# Altium schematic sheet N-CW7_Main.SchDoc
size A3; SheetNumber: 1; SheetTotal: 3
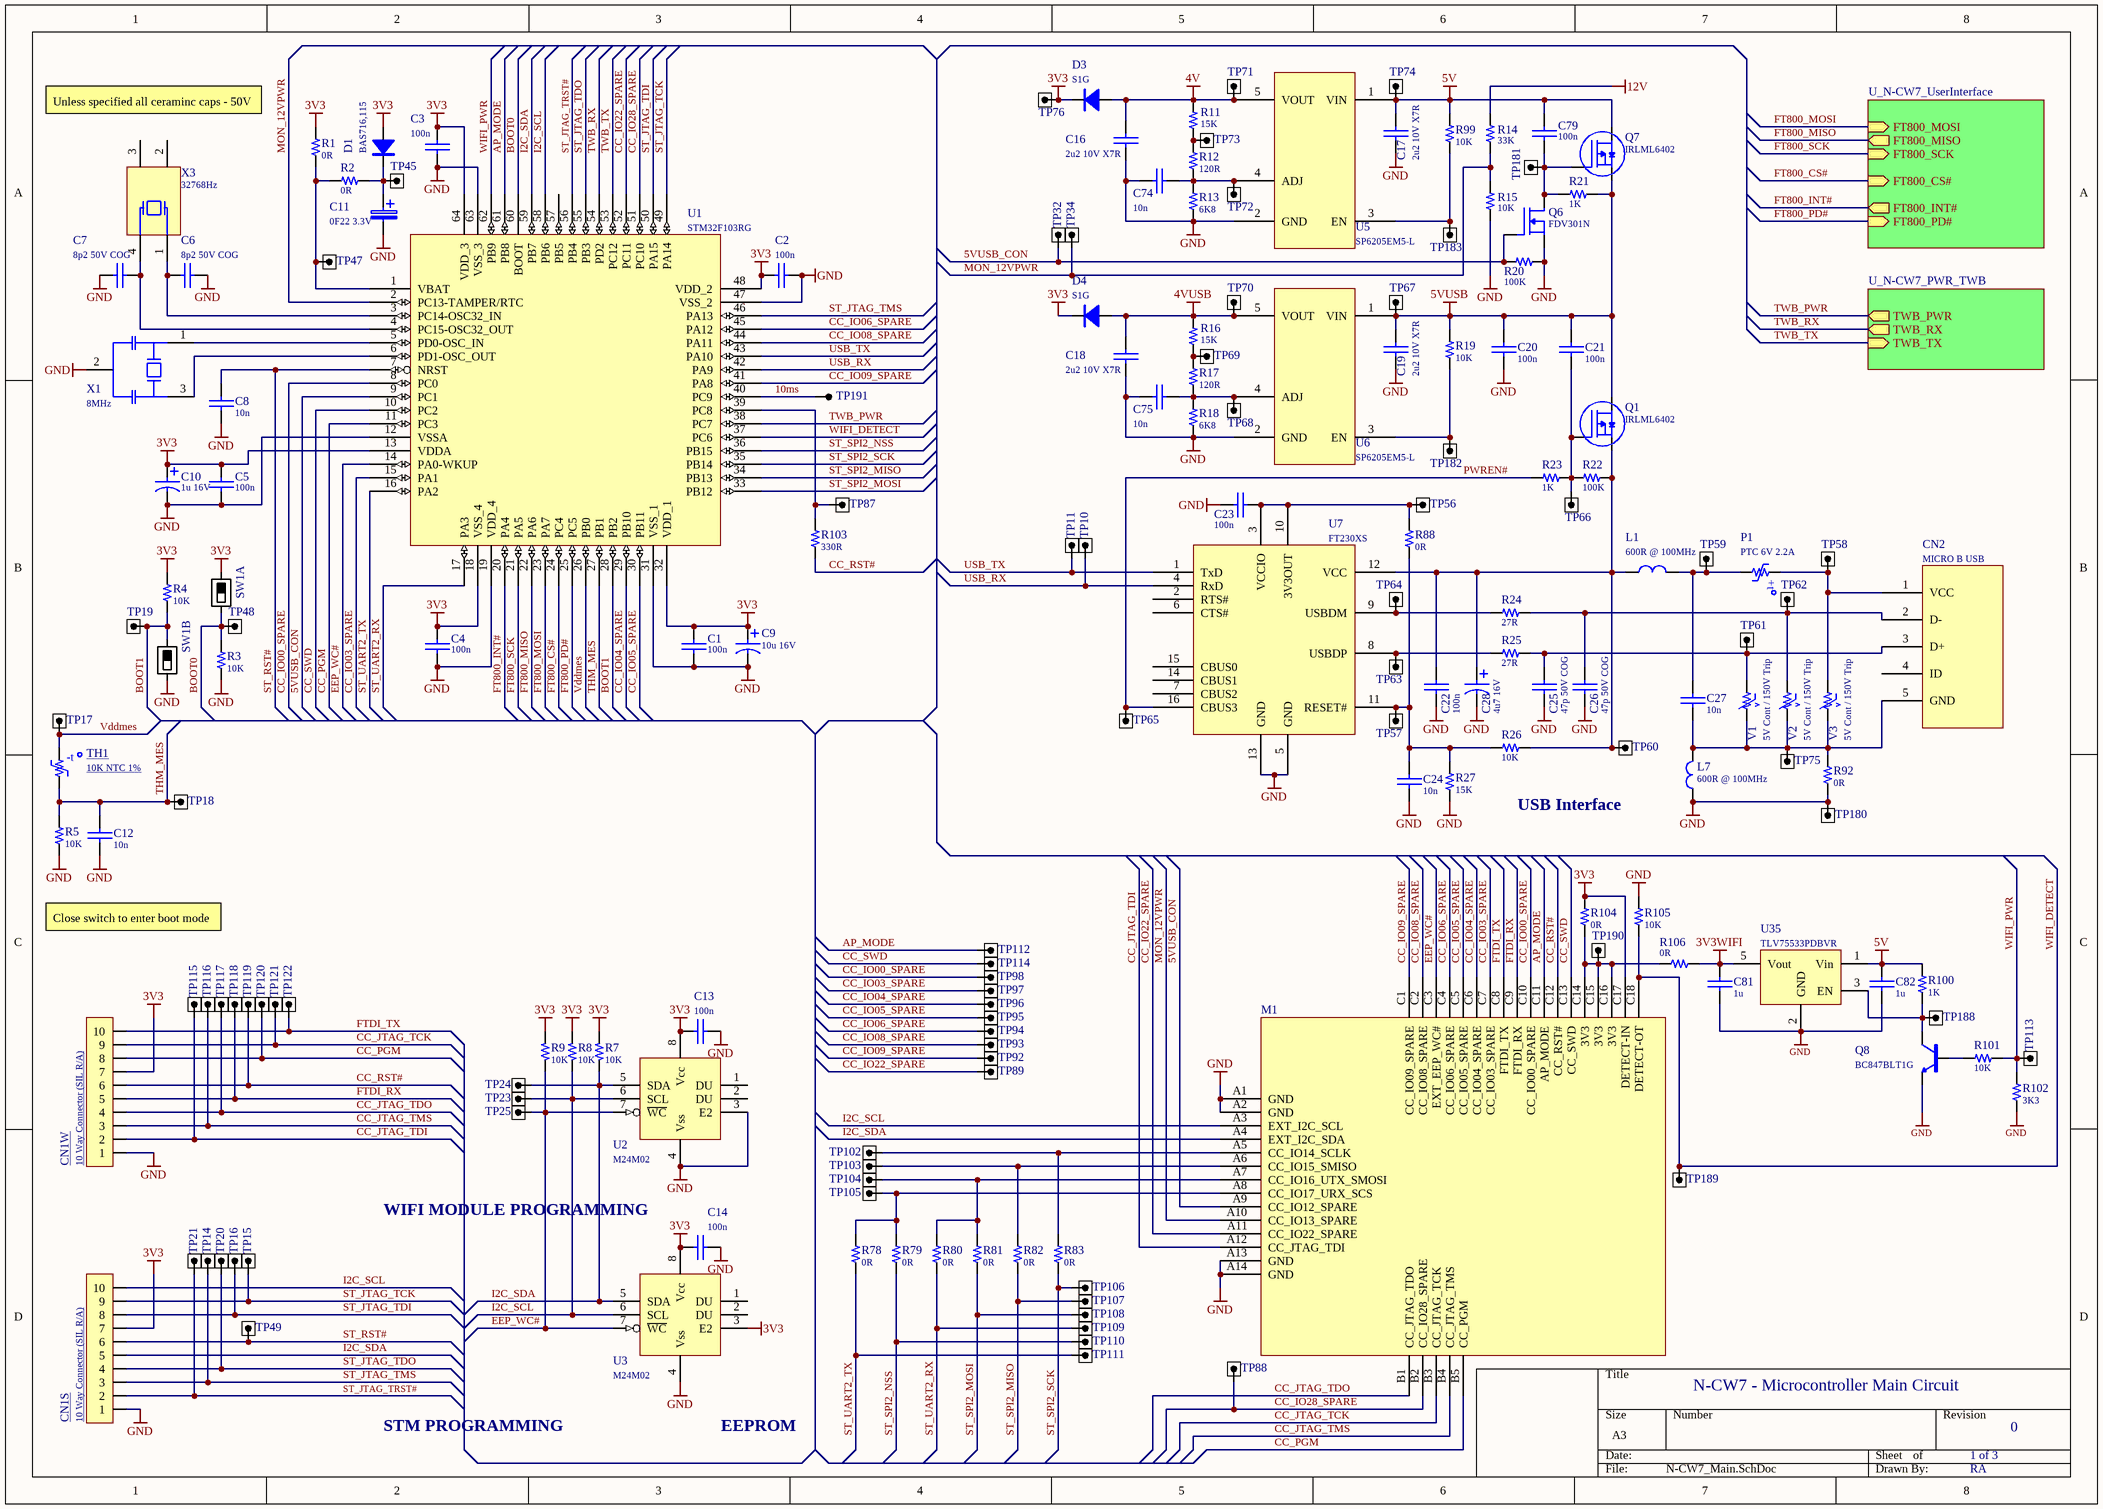
[diagram p0: N-CW7_Main.SchDoc]

## Parts
C1  100n  [TDK_0603_T0.80:CAPC1608X08N]
C2  100n  [TDK_0603_T0.80:CAPC1608X08N]
C3  100n  [TDK_0603_T0.80:CAPC1608X08N]
C4  100n  [TDK_0603_T0.80:CAPC1608X08N]
C5  100n  [TDK_0603_T0.80:CAPC1608X08N]
C6  8p2 50V COG  [KEMET_0603_T0.80:CAPC1608X08N]
C7  8p2 50V COG  [KEMET_0603_T0.80:CAPC1608X08N]
C8  10n  [TDK_0603_T0.80:CAPC1608X08N]
C9  10u 16V  [KEMET_T494B/3528-21:CAPMP3528X19N]
C10  1u 16V  [KEMET_T494A/3216-18:CAPCP3216X16N]
C11  0F22 3.3V  [ELNA_RSCSK2243R3D02008U]
C12  10n  [TDK_0603_T0.80:CAPC1608X08N]
C13  100n  [TDK_0603_T0.80:CAPC1608X08N]
C14  100n  [TDK_0603_T0.80:CAPC1608X08N]
C16  2u2 10V X7R  [TDK_0603_T0.80:CAPC1608X08N]
C17  2u2 10V X7R  [TDK_0603_T0.80:CAPC1608X08N]
C18  2u2 10V X7R  [TDK_0603_T0.80:CAPC1608X08N]
C19  2u2 10V X7R  [TDK_0603_T0.80:CAPC1608X08N]
C20  100n  [TDK_0603_T0.80:CAPC1608X08N]
C21  100n  [TDK_0603_T0.80:CAPC1608X08N]
C22  100n  [TDK_0603_T0.80:CAPC1608X08N]
C23  100n  [TDK_0603_T0.80:CAPC1608X08N]
C24  10n  [TDK_0603_T0.80:CAPC1608X08N]
C25  47p 50V COG  [TDK_0603_T0.80:CAPC1608X08N]
C26  47p 50V COG  [TDK_0603_T0.80:CAPC1608X08N]
C27  10n  [TDK_0603_T0.80:CAPC1608X08N]
C28  4u7 16V  [KEMET_T494A/3216-18:CAPCP3216X16N]
C74  10n  [TDK_0603_T0.80:CAPC1608X08N]
C75  10n  [TDK_0603_T0.80:CAPC1608X08N]
C79  100n  [TDK_0603_T0.80:CAPC1608X08N]
C81  1u  [KEMET_1210_T1.55:CAPC3225X16N]
C82  1u  [KEMET_1210_T1.55:CAPC3225X16N]
CN1S  10 Way Connector (SIL R/A)  [SULLINS_PPTC101LGBN-RC]
CN1W  10 Way Connector (SIL R/A)  [SULLINS_PPTC101LGBN-RC]
CN2  MICRO B USB  [MOLEX:47346-1001]
D1  BAS716,115  [NEXPERIA_BAS716,115_SOD523:SODFL160X65-2N]
D3  S1G  [DIODESINC_S1G_SMA_D0214AC:DIOM4326X24N]
D4  S1G  [DIODESINC_S1G_SMA_D0214AC:DIOM4326X24N]
L1  600R @ 100MHz  [LAIRD_MI0805K601R-10:INDC2012X09N]
L7  600R @ 100MHz  [LAIRD_MI0805K601R-10:INDC2012X09N]
M1  MB-WIFI-CC3200Rev00  [MB-WIFI-CC3200Rev00]  (value not drawn)
P1  PTC 6V 2.2A  [BOURNS_MF-MSMF110-2:INDC4632X08N]
Q1  IRLML6402  [IR_IRLML6402TRPBF_SOT23:SOT95P237X112-3N]
Q6  FDV301N  [ONSEMI_FDV301N_SOT23:SOT95P230X110-3N]
Q7  IRLML6402  [IR_IRLML6402TRPBF_SOT23:SOT95P237X112-3N]
Q8  BC847BLT1G  [ONSEMI_BC847BLT1G_SOT23:SOT95P230X110-3N]
R1  0R  [YAGEO_0603_T0.55:RESC1608X06N]
R2  0R  [YAGEO_0603_T0.55:RESC1608X06N]
R3  10K  [YAGEO_0603_T0.55:RESC1608X06N]
R4  10K  [YAGEO_0603_T0.55:RESC1608X06N]
R5  10K  [YAGEO_0603_T0.55:RESC1608X06N]
R7  10K  [YAGEO_0603_T0.55:RESC1608X06N]
R8  10K  [YAGEO_0603_T0.55:RESC1608X06N]
R9  10K  [YAGEO_0603_T0.55:RESC1608X06N]
R11  15K  [YAGEO_0603_T0.55:RESC1608X06N]
R12  120R  [YAGEO_0603_T0.55:RESC1608X06N]
R13  6K8  [YAGEO_0603_T0.55:RESC1608X06N]
R14  33K  [YAGEO_0603_T0.55:RESC1608X06N]
R15  10K  [YAGEO_0603_T0.55:RESC1608X06N]
R16  15K  [YAGEO_0603_T0.55:RESC1608X06N]
R17  120R  [YAGEO_0603_T0.55:RESC1608X06N]
R18  6K8  [YAGEO_0603_T0.55:RESC1608X06N]
R19  10K  [YAGEO_0603_T0.55:RESC1608X06N]
R20  100K  [YAGEO_0603_T0.55:RESC1608X06N]
R21  1K  [YAGEO_0603_T0.55:RESC1608X06N]
R22  100K  [YAGEO_0603_T0.55:RESC1608X06N]
R23  1K  [YAGEO_0603_T0.55:RESC1608X06N]
R24  27R  [YAGEO_0603_T0.55:RESC1608X06N]
R25  27R  [YAGEO_0603_T0.55:RESC1608X06N]
R26  10K  [YAGEO_0603_T0.55:RESC1608X06N]
R27  15K  [YAGEO_0603_T0.55:RESC1608X06N]
R78  0R  [YAGEO_0603_T0.55:RESC1608X06N]
R79  0R  [YAGEO_0603_T0.55:RESC1608X06N]
R80  0R  [YAGEO_0603_T0.55:RESC1608X06N]
R81  0R  [YAGEO_0603_T0.55:RESC1608X06N]
R82  0R  [YAGEO_0603_T0.55:RESC1608X06N]
R83  0R  [YAGEO_0603_T0.55:RESC1608X06N]
R88  0R  [YAGEO_0603_T0.55:RESC1608X06N]
R92  0R  [YAGEO_0603_T0.55:RESC1608X06N]
R99  10K  [YAGEO_0603_T0.55:RESC1608X06N]
R100  1K  [YAGEO_0603_T0.55:RESC1608X06N]
R101  10K  [YAGEO_0603_T0.55:RESC1608X06N]
R102  3K3  [YAGEO_0603_T0.55:RESC1608X06N]
R103  330R  [YAGEO_0603_T0.55:RESC1608X06N]
R104  0R  [YAGEO_0603_T0.55:RESC1608X06N]
R105  10K  [YAGEO_0603_T0.55:RESC1608X06N]
R106  0R  [YAGEO_0603_T0.55:RESC1608X06N]
SW1A  SPST  [COPAL_CHS-02B]  (value not drawn)
SW1B  SPST  [COPAL_CHS-02B]  (value not drawn)
TH1  10K NTC 1%  [NETWORKER_THERMISTOR_2.54MM]
TP10  TESTPOINT_OCTAGONAL  [TESTPOINT_OCTAGONAL]  (value not drawn)
TP11  TESTPOINT_OCTAGONAL  [TESTPOINT_OCTAGONAL]  (value not drawn)
TP14  TESTPOINT_OCTAGONAL  [TESTPOINT_OCTAGONAL]  (value not drawn)
TP15  TESTPOINT_OCTAGONAL  [TESTPOINT_OCTAGONAL]  (value not drawn)
TP16  TESTPOINT_OCTAGONAL  [TESTPOINT_OCTAGONAL]  (value not drawn)
TP17  TESTPOINT_OCTAGONAL  [TESTPOINT_OCTAGONAL]  (value not drawn)
TP18  TESTPOINT_OCTAGONAL  [TESTPOINT_OCTAGONAL]  (value not drawn)
TP19  TESTPOINT_OCTAGONAL  [TESTPOINT_OCTAGONAL]  (value not drawn)
TP20  TESTPOINT_OCTAGONAL  [TESTPOINT_OCTAGONAL]  (value not drawn)
TP21  TESTPOINT_OCTAGONAL  [TESTPOINT_OCTAGONAL]  (value not drawn)
TP23  TESTPOINT_OCTAGONAL  [TESTPOINT_OCTAGONAL]  (value not drawn)
TP24  TESTPOINT_OCTAGONAL  [TESTPOINT_OCTAGONAL]  (value not drawn)
TP25  TESTPOINT_OCTAGONAL  [TESTPOINT_OCTAGONAL]  (value not drawn)
TP32  TESTPOINT_OCTAGONAL  [TESTPOINT_OCTAGONAL]  (value not drawn)
TP34  TESTPOINT_OCTAGONAL  [TESTPOINT_OCTAGONAL]  (value not drawn)
TP45  TESTPOINT_OCTAGONAL  [TESTPOINT_OCTAGONAL]  (value not drawn)
TP47  TESTPOINT_OCTAGONAL  [TESTPOINT_OCTAGONAL]  (value not drawn)
TP48  TESTPOINT_OCTAGONAL  [TESTPOINT_OCTAGONAL]  (value not drawn)
TP49  TESTPOINT_OCTAGONAL  [TESTPOINT_OCTAGONAL]  (value not drawn)
TP56  TESTPOINT_OCTAGONAL  [TESTPOINT_OCTAGONAL]  (value not drawn)
TP57  TESTPOINT_OCTAGONAL  [TESTPOINT_OCTAGONAL]  (value not drawn)
TP58  TESTPOINT_OCTAGONAL  [TESTPOINT_OCTAGONAL]  (value not drawn)
TP59  TESTPOINT_OCTAGONAL  [TESTPOINT_OCTAGONAL]  (value not drawn)
TP60  TESTPOINT_OCTAGONAL  [TESTPOINT_OCTAGONAL]  (value not drawn)
TP61  TESTPOINT_OCTAGONAL  [TESTPOINT_OCTAGONAL]  (value not drawn)
TP62  TESTPOINT_OCTAGONAL  [TESTPOINT_OCTAGONAL]  (value not drawn)
TP63  TESTPOINT_OCTAGONAL  [TESTPOINT_OCTAGONAL]  (value not drawn)
TP64  TESTPOINT_OCTAGONAL  [TESTPOINT_OCTAGONAL]  (value not drawn)
TP65  TESTPOINT_OCTAGONAL  [TESTPOINT_OCTAGONAL]  (value not drawn)
TP66  TESTPOINT_OCTAGONAL  [TESTPOINT_OCTAGONAL]  (value not drawn)
TP67  TESTPOINT_OCTAGONAL  [TESTPOINT_OCTAGONAL]  (value not drawn)
TP68  TESTPOINT_OCTAGONAL  [TESTPOINT_OCTAGONAL]  (value not drawn)
TP69  TESTPOINT_OCTAGONAL  [TESTPOINT_OCTAGONAL]  (value not drawn)
TP70  TESTPOINT_OCTAGONAL  [TESTPOINT_OCTAGONAL]  (value not drawn)
TP71  TESTPOINT_OCTAGONAL  [TESTPOINT_OCTAGONAL]  (value not drawn)
TP72  TESTPOINT_OCTAGONAL  [TESTPOINT_OCTAGONAL]  (value not drawn)
TP73  TESTPOINT_OCTAGONAL  [TESTPOINT_OCTAGONAL]  (value not drawn)
TP74  TESTPOINT_OCTAGONAL  [TESTPOINT_OCTAGONAL]  (value not drawn)
TP75  TESTPOINT_OCTAGONAL  [TESTPOINT_OCTAGONAL]  (value not drawn)
TP76  TESTPOINT_OCTAGONAL  [TESTPOINT_OCTAGONAL]  (value not drawn)
TP87  TESTPOINT_OCTAGONAL  [TESTPOINT_OCTAGONAL]  (value not drawn)
TP88  TESTPOINT_OCTAGONAL  [TESTPOINT_OCTAGONAL]  (value not drawn)
TP89  TESTPOINT_OCTAGONAL  [TESTPOINT_OCTAGONAL]  (value not drawn)
TP92  TESTPOINT_OCTAGONAL  [TESTPOINT_OCTAGONAL]  (value not drawn)
TP93  TESTPOINT_OCTAGONAL  [TESTPOINT_OCTAGONAL]  (value not drawn)
TP94  TESTPOINT_OCTAGONAL  [TESTPOINT_OCTAGONAL]  (value not drawn)
TP95  TESTPOINT_OCTAGONAL  [TESTPOINT_OCTAGONAL]  (value not drawn)
TP96  TESTPOINT_OCTAGONAL  [TESTPOINT_OCTAGONAL]  (value not drawn)
TP97  TESTPOINT_OCTAGONAL  [TESTPOINT_OCTAGONAL]  (value not drawn)
TP98  TESTPOINT_OCTAGONAL  [TESTPOINT_OCTAGONAL]  (value not drawn)
TP102  TESTPOINT_OCTAGONAL  [TESTPOINT_OCTAGONAL]  (value not drawn)
TP103  TESTPOINT_OCTAGONAL  [TESTPOINT_OCTAGONAL]  (value not drawn)
TP104  TESTPOINT_OCTAGONAL  [TESTPOINT_OCTAGONAL]  (value not drawn)
TP105  TESTPOINT_OCTAGONAL  [TESTPOINT_OCTAGONAL]  (value not drawn)
TP106  TESTPOINT_OCTAGONAL  [TESTPOINT_OCTAGONAL]  (value not drawn)
TP107  TESTPOINT_OCTAGONAL  [TESTPOINT_OCTAGONAL]  (value not drawn)
TP108  TESTPOINT_OCTAGONAL  [TESTPOINT_OCTAGONAL]  (value not drawn)
TP109  TESTPOINT_OCTAGONAL  [TESTPOINT_OCTAGONAL]  (value not drawn)
TP110  TESTPOINT_OCTAGONAL  [TESTPOINT_OCTAGONAL]  (value not drawn)
TP111  TESTPOINT_OCTAGONAL  [TESTPOINT_OCTAGONAL]  (value not drawn)
TP112  TESTPOINT_OCTAGONAL  [TESTPOINT_OCTAGONAL]  (value not drawn)
TP113  TESTPOINT_OCTAGONAL  [TESTPOINT_OCTAGONAL]  (value not drawn)
TP114  TESTPOINT_OCTAGONAL  [TESTPOINT_OCTAGONAL]  (value not drawn)
TP115  TESTPOINT_OCTAGONAL  [TESTPOINT_OCTAGONAL]  (value not drawn)
TP116  TESTPOINT_OCTAGONAL  [TESTPOINT_OCTAGONAL]  (value not drawn)
TP117  TESTPOINT_OCTAGONAL  [TESTPOINT_OCTAGONAL]  (value not drawn)
TP118  TESTPOINT_OCTAGONAL  [TESTPOINT_OCTAGONAL]  (value not drawn)
TP119  TESTPOINT_OCTAGONAL  [TESTPOINT_OCTAGONAL]  (value not drawn)
TP120  TESTPOINT_OCTAGONAL  [TESTPOINT_OCTAGONAL]  (value not drawn)
TP121  TESTPOINT_OCTAGONAL  [TESTPOINT_OCTAGONAL]  (value not drawn)
TP122  TESTPOINT_OCTAGONAL  [TESTPOINT_OCTAGONAL]  (value not drawn)
TP180  TESTPOINT_OCTAGONAL  [TESTPOINT_OCTAGONAL]  (value not drawn)
TP181  TESTPOINT_OCTAGONAL  [TESTPOINT_OCTAGONAL]  (value not drawn)
TP182  TESTPOINT_OCTAGONAL  [TESTPOINT_OCTAGONAL]  (value not drawn)
TP183  TESTPOINT_OCTAGONAL  [TESTPOINT_OCTAGONAL]  (value not drawn)
TP188  TESTPOINT_OCTAGONAL  [TESTPOINT_OCTAGONAL]  (value not drawn)
TP189  TESTPOINT_OCTAGONAL  [TESTPOINT_OCTAGONAL]  (value not drawn)
TP190  TESTPOINT_OCTAGONAL  [TESTPOINT_OCTAGONAL]  (value not drawn)
TP191  TESTPOINT_ROUND  [TESTPOINT_ROUND]  (value not drawn)
U1  STM32F103RG  [STM_STM32F103RG_LQFP64:TSQFP50P1200X1200X160-64N]
U2  M24M02  [STM_M24M02-DR_SOIC8:SOIC127P600X175-8N]
U3  M24M02  [STM_M24M02-DR_SOIC8:SOIC127P600X175-8N]
U5  SP6205EM5-L  [EXAR_SP6205EM5-L_SOT23_5:SOT95P280X145-5N]
U6  SP6205EM5-L  [EXAR_SP6205EM5-L_SOT23_5:SOT95P280X145-5N]
U7  FT230XS  [FTDI_FT230XS_SOP64P600X175-16N]
U35  TLV75533PDBVR  [TI_TLV75533PDBVR_SOT23_5:SOT95P280X145-5N]
V1  5V Cont / 150V Trip  [BOURNS_CGA0603MLC:INDC1608X04N]
V2  5V Cont / 150V Trip  [BOURNS_CGA0603MLC:INDC1608X04N]
V3  5V Cont / 150V Trip  [BOURNS_CGA0603MLC:INDC1608X04N]
X1  8MHz  [MURATA_CSTNE8M00G550000R0]
X3  32768Hz  [EPSON_MC-146]

## Sub-sheets
U_N-CW7_PWR_TWB = N-CW7_PWR_TWB.SchDoc: TWB_TX (in), TWB_RX (out), TWB_PWR (out)
U_N-CW7_UserInterface = N-CW7_UserInterface.SchDoc: FT800_MOSI (in), FT800_MISO (out), FT800_SCK (in), FT800_PD# (in), FT800_INT# (out), FT800_CS# (in)

## Nets
3V3: C1.1 C2.1 C3.1 C4.1 C5.1 C9.1 C10.1 C13.2 C14.2 CN1S.7 CN1W.7 D1.2(A) D3.1(K) D4.1(K) M1.C17(DETECT-IN) R1.1 R4.2 R7.2 R8.2 R9.2 R104.1 SW1A.1 TP76.1 U1.13(VDDA) U1.18(VSS_4) U1.32(VDD_1) U1.48(VDD_2) U1.64(VDD_3) U2.8(Vcc) U3.3(E2) U3.8(Vcc)
3V3WIFI: C81.2 R106.2 U35.5(Vout)
4V: C16.2 D3.2(A) R11.2 TP71.1 U5.5(VOUT)
4VUSB: C18.2 D4.2(A) R16.2 TP70.1 U6.5(VOUT)
5V: C17.2 C79.1 C82.2 Q7.3(D) R99.1 R100.2 TP74.1 U5.1(VIN) U35.1(Vin)
5VUSB: C19.2 C20.1 C21.2 Q1.3(D) Q7.2(S) R19.1 R21.1 TP67.1 U6.1(VIN)
12V: R14.2
GND: C1.2 C2.2 C3.2 C4.2 C5.2 C6.2 C7.1 C8.1 C9.2 C10.2 C11.2 C12.1 C13.1 C14.1 C16.1 C17.1 C18.1 C19.1 C20.2 C22.2 C23.1 C24.2 C25.1 C26.1 C28.2 C74.2 C75.2 C81.1 C82.1 CN1S.1 CN1W.1 L7.1 M1.A1(GND) M1.A2(GND) M1.A13(GND) M1.A14(GND) Q6.2(S) Q8.2(E) R3.1 R5.1 R13.1 R15.1 R18.1 R20.1 R27.1 R92.1 R102.2 R105.1 SW1B.2 TP180.1 U1.12(VSSA) U1.19(VDD_4) U1.31(VSS_1) U1.47(VSS_2) U1.63(VSS_3) U2.3(E2) U2.4(Vss) U3.4(Vss) U5.2(GND) U6.2(GND) U7.5(GND) U7.13(GND) U35.2(GND) X1.2
5VUSB_CON: M1.A9(CC_IO12_SPARE) Q6.1(G) R20.2 TP32.1 U1.9(PC1)
10ms: TP191.1 U1.40(PC9)
AP_MODE: M1.C11(AP_MODE) TP112.1 U1.61(PB8)
BOOT0: R3.2 SW1A.2 TP48.1 U1.60(BOOT)
BOOT1: R4.1 SW1B.1 TP19.1 U1.28(PB2)
CC_IO00_SPARE: M1.C10(CC_IO00_SPARE) TP98.1 U1.8(PC0)
CC_IO03_SPARE: M1.C7(CC_IO03_SPARE) TP97.1 U1.15(PA1)
CC_IO04_SPARE: M1.C6(CC_IO04_SPARE) TP96.1 U1.29(PB10)
CC_IO05_SPARE: M1.C5(CC_IO05_SPARE) TP95.1 U1.30(PB11)
CC_IO06_SPARE: M1.C4(CC_IO06_SPARE) TP94.1 U1.45(PA12)
CC_IO08_SPARE: M1.C2(CC_IO08_SPARE) TP93.1 U1.44(PA11)
CC_IO09_SPARE: M1.C1(CC_IO09_SPARE) TP92.1 U1.41(PA8)
CC_IO22_SPARE: M1.A11(CC_IO22_SPARE) TP89.1 U1.52(PC11)
CC_IO28_SPARE: M1.B2(CC_IO28_SPARE) TP88.1 U1.51(PC10)
CC_JTAG_TCK: CN1W.9 M1.B3(CC_JTAG_TCK) TP121.1
CC_JTAG_TDI: CN1W.2 M1.A12(CC_JTAG_TDI) TP115.1
CC_JTAG_TDO: CN1W.4 M1.B1(CC_JTAG_TDO) TP117.1
CC_JTAG_TMS: CN1W.3 M1.B4(CC_JTAG_TMS) TP116.1
CC_PGM: CN1W.8 M1.B5(CC_PGM) TP120.1 U1.11(PC3)
CC_RST#: CN1W.6 M1.C12(CC_RST#) R103.1 TP119.1
CC_SWD: M1.C13(CC_SWD) TP114.1 U1.10(PC2)
EEP_WC#: M1.C3(EXT_EEP_WC#) R9.1 TP25.1 U1.14(PA0-WKUP) U2.7(~{WC}) U3.7(~{WC})
FT800_CS#: U1.24(PC4) ; sheet U_N-CW7_UserInterface/FT800_CS#
FT800_INT#: U1.20(PA4) ; sheet U_N-CW7_UserInterface/FT800_INT#
FT800_MISO: U1.22(PA6) ; sheet U_N-CW7_UserInterface/FT800_MISO
FT800_MOSI: U1.23(PA7) ; sheet U_N-CW7_UserInterface/FT800_MOSI
FT800_PD#: U1.25(PC5) ; sheet U_N-CW7_UserInterface/FT800_PD#
FT800_SCK: U1.21(PA5) ; sheet U_N-CW7_UserInterface/FT800_SCK
FTDI_RX: CN1W.5 M1.C9(FTDI_RX) TP118.1
FTDI_TX: CN1W.10 M1.C8(FTDI_TX) TP122.1
I2C_SCL: CN1S.10 M1.A3(EXT_I2C_SCL) R8.1 TP23.1 U1.58(PB6) U2.6(SCL) U3.6(SCL)
I2C_SDA: CN1S.5 M1.A4(EXT_I2C_SDA) R7.1 TP24.1 U1.59(PB7) U2.5(SDA) U3.5(SDA)
MON_12VPWR: M1.A10(CC_IO13_SPARE) R14.1 R15.2 TP34.1 U1.2(PC13-TAMPER/RTC)
PWREN#: R23.1 TP65.1 U7.16(CBUS3)
ST_JTAG_TCK: CN1S.9 TP15.1 U1.49(PA14)
ST_JTAG_TDI: CN1S.8 TP16.1 U1.50(PA15)
ST_JTAG_TDO: CN1S.4 TP20.1 U1.55(PB3)
ST_JTAG_TMS: CN1S.3 TP14.1 U1.46(PA13)
ST_JTAG_TRST#: CN1S.2 TP21.1 U1.56(PB4)
ST_RST#: C8.2 CN1S.6 TP49.1 U1.7(NRST)
ST_SPI2_MISO: R82.2 TP107.1 U1.34(PB13)
ST_SPI2_MOSI: R81.2 TP108.1 U1.33(PB12)
ST_SPI2_NSS: R79.2 TP110.1 U1.36(PB15)
ST_SPI2_SCK: R83.2 TP106.1 U1.35(PB14)
ST_UART2_RX: R80.2 TP109.1 U1.17(PA3)
ST_UART2_TX: R78.2 TP111.1 U1.16(PA2)
THM_MES: C12.2 R5.2 TH1.1 TP18.1 U1.27(PB1)
TWB_PWR: U1.38(PC7) ; sheet U_N-CW7_PWR_TWB/TWB_PWR
TWB_RX: U1.54(PD2) ; sheet U_N-CW7_PWR_TWB/TWB_RX
TWB_TX: U1.53(PC12) ; sheet U_N-CW7_PWR_TWB/TWB_TX
USB_RX: TP10.1 U1.42(PA9) U7.4(RxD)
USB_TX: TP11.1 U1.43(PA10) U7.1(TxD)
Vddmes: TH1.2 TP17.1 U1.26(PB0)
WIFI_DETECT: M1.C18(DETECT-OT) R105.2 TP189.1 U1.37(PC6)
WIFI_PWR: R101.1 R102.1 TP113.1 U1.62(PB9)
NetC6_1: C6.1 U1.3(PC14-OSC32_IN) X3.1
NetC7_2: C7.2 U1.4(PC15-OSC32_OUT) X3.4
NetC11_1: C11.1 D1.1(K) R2.2 TP45.1
NetC21_1: C21.1 Q1.1(G) R22.2 R23.2 TP66.1
NetC22_1: C22.1 C28.1 L1.1 Q1.2(S) R22.1 R26.2 TP60.1 U7.12(VCC)
NetC23_2: C23.2 R88.1 TP56.1 U7.3(VCCIO) U7.10(3V3OUT)
NetC24_1: C24.1 R26.1 R27.2 R88.2 TP57.1 U7.11(RESET#)
NetC25_2: C25.2 CN2.3(D+) R25.2 TP61.1 V1.2
NetC26_2: C26.2 CN2.2(D-) R24.2 TP62.1 V2.2
NetC27_1: C27.1 L1.2 P1.1 TP59.1
NetC27_2: C27.2 CN2.5(GND) L7.2 R92.2 TP75.1 V1.1 V2.1 V3.1
NetC74_1: C74.1 R12.1 R13.2 TP72.1 U5.4(ADJ)
NetC75_1: C75.1 R17.1 R18.2 TP68.1 U6.4(ADJ)
NetC79_2: C79.2 Q6.3(D) Q7.1(G) R21.2 TP181.1
NetCN2_1: CN2.1(VCC) P1.2 TP58.1 V3.2
NetM1_A5: M1.A5(CC_IO14_SCLK) R83.1 TP102.1
NetM1_A6: M1.A6(CC_IO15_SMISO) R82.1 TP103.1
NetM1_A7: M1.A7(CC_IO16_UTX_SMOSI) R80.1 R81.1 TP104.1
NetM1_A8: M1.A8(CC_IO17_URX_SCS) R78.1 R79.1 TP105.1
NetM1_C14: M1.C14(3V3) M1.C15(3V3) M1.C16(3V3) R104.2 R106.1 TP190.1
NetQ8_1: Q8.1(B) R101.2
NetQ8_3: Q8.3(C) R100.1 TP188.1 U35.3(EN)
NetR1_2: R1.2 R2.1 TP47.1 U1.1(VBAT)
NetR11_1: R11.1 R12.2 TP73.1
NetR16_1: R16.1 R17.2 TP69.1
NetR19_2: R19.2 TP182.1 U6.3(EN)
NetR24_1: R24.1 TP64.1 U7.9(USBDM)
NetR25_1: R25.1 TP63.1 U7.8(USBDP)
NetR99_2: R99.2 TP183.1 U5.3(EN)
NetR103_2: R103.2 TP87.1 U1.39(PC8)
NetU1_5: U1.5(PD0-OSC_IN) X1.1
NetU1_6: U1.6(PD1-OSC_OUT) X1.3

Not connected (* = marked no-connect by the designer): CN2 4(ID); U1 57(PB5); U2 1(DU) 2(DU); U3 1(DU) 2(DU); U7 2(RTS#) 6(CTS#) 7(CBUS2) 14(CBUS1) 15(CBUS0); X3 2 3

## Notes on the sheet
- Unless specified all ceraminc caps - 50V X7R
- USB Interface
- Close switch to enter boot mode
- WIFI MODULE PROGRAMMING
- N-CW7 - Microcontroller Main Circuit
- STM PROGRAMMING
- EEPROM
- 1 of 3
- 0
- RA
- (in symbol BOURNS_MF-MSMF110-2) +t
- (in symbol NETWORKER_THERMISTOR) -t

## Library data of the parts
C1-C5 C13 C14 C20-C23 C79 = TDK_0603_T0.80: CAP CER 0.1UF 50V X7R 0603; Manufacturer: TDK; Manufacturer Part Number: C1608X7R1H104K080AA; ComponentLink1Description: Datasheet - TDK; ComponentLink1URL: https://product.tdk.com/system/files/dam/doc/product/capacitor/ceramic/mlcc/catalog/mlcc_commercial_general_en.pdf; Supplier 1: Digi-Key; Supplier Part Number 1: 445-1314-1-ND; Supplier 2: Mouser; Supplier Part Number 2: 810-C1608X7R1H104K
C6 C7 = KEMET_0603_T0.80: CAP CER 8.2PF 50V C0G/NP0 0603; Manufacturer: KEMET; Manufacturer Part Number: C0603C829C5GACTU; ComponentLink1Description: Datasheet - KEMET; ComponentLink1URL: https://datasheet.ciiva.com/145/docfinderpartnumber-c0603c475k9pactu-145072.pdf?src-supplier=Digikey; Supplier 1: Mouser; Supplier Part Number 1: 80-C0603C829C5G; Supplier 2: Digikey; Supplier Part Number 2: 399-C0603C829C5GACTUCT-ND
C8 C12 C24 C27 C74 C75 = TDK_0603_T0.80: CAP CER 10000PF 50V X7R 0603; Manufacturer: TDK; Manufacturer Part Number: C1608X7R1H103K080AA; ComponentLink1Description: Datasheet - TDK; ComponentLink1URL: https://product.tdk.com/system/files/dam/doc/product/capacitor/ceramic/mlcc/catalog/mlcc_commercial_general_en.pdf; Supplier 1: Digi-Key; Supplier Part Number 1: 445-1311-1-ND; Supplier 2: Mouser; Supplier Part Number 2: 810-C1608X7R1H103K
C9 = KEMET_T494B/EIA3528-21: CAP TANT 10UF 10% 16V 1411; Manufacturer: KEMET; Manufacturer Part Number: T494B106K016AT; ComponentLink1Description: Datasheet - KEMET; ComponentLink1URL: https://datasheet.ciiva.com/6229/kem-t2008-t494-6229597.pdf?src-supplier=Digi-Key; Supplier 1: Mouser; Supplier Part Number 1: 80-T494B106K016; Supplier 2: Digikey; Supplier Part Number 2: 399-3830-1-ND
C10 = KEMET_T494A/EIA3216-18: CAP TANT 1UF 10% 16V 1206; Manufacturer: KEMET; Manufacturer Part Number: T494A105K016AT; ComponentLink1Description: Datasheet - KEMET; ComponentLink1URL: https://datasheet.ciiva.com/6229/kem-t2008-t494-6229597.pdf?src-supplier=Digi-Key; Supplier 1: Digi-Key; Supplier Part Number 1: 399-8427-1-ND; Supplier 2: Mouser; Supplier Part Number 2: 80-T494A105K016
C11 = ELNA_RSCSK2243R3D02008U: CAP 220MF -20% +80% 3.3V SMD; Manufacturer: Elna; Manufacturer Part Number: RSCSK2243R3D02008U; Supplier 1: Digikey; Supplier Part Number 1: 604-RSCSK2243R3D02008UCT-ND; ComponentLink1Description: Datasheet - ELNA; ComponentLink1URL: https://mm.digikey.com/Volume0/opasdata/d220001/medias/docus/875/DS%2CDSK.pdf
C16-C19 = TDK_0603_T0.80: CAP CER 2.2UF 10V X7R 0603; Manufacturer: TDK; Manufacturer Part Number: C1608X7R1A225K080AC; ComponentLink1Description: Datasheet - TDK; ComponentLink1URL: https://product.tdk.com/system/files/dam/doc/product/capacitor/ceramic/mlcc/catalog/mlcc_commercial_general_en.pdf; Supplier 1: Digikey; Supplier Part Number 1: 445-5958-1-ND; Supplier 2: Mouser; Supplier Part Number 2: 810-C1608X7R1A225K
C25 C26 = TDK_0603_T0.80: CAP CER 47PF 50V C0G 0603; Manufacturer: TDK; Manufacturer Part Number: C1608C0G1H470J080AA; ComponentLink1Description: Datasheet - TDK; ComponentLink1URL: https://product.tdk.com/system/files/dam/doc/product/capacitor/ceramic/mlcc/catalog/mlcc_commercial_general_en.pdf; Supplier 1: Digikey; Supplier Part Number 1: 445-1277-2-ND; Supplier 2: Mouser; Supplier Part Number 2: 810-C1608C0G1H470J
C28 = KEMET_T494A/EIA3216-18: CAP TANT 4.7UF 10% 16V 1206; Manufacturer: KEMET; Manufacturer Part Number: T494A475K016AT; ComponentLink1Description: Datasheet - KEMET; ComponentLink1URL: https://datasheet.ciiva.com/6229/kem-t2008-t494-6229597.pdf?src-supplier=Digi-Key; Supplier 1: Mouser; Supplier Part Number 1: 80-T494A475K016; Supplier 2: Digikey; Supplier Part Number 2: 399-8439-1-ND
C81 C82 = KEMET_1210_T1.55: CAP CER 1UF 50V X5R 1210; Manufacturer: KEMET; Manufacturer Part Number: C1210C105K5PACTU; ComponentLink1Description: Datasheet - KEMET; ComponentLink1URL: https://content.kemet.com/datasheets/KEM_C1006_X5R_SMD.pdf; Supplier 1: Digi-Key; Supplier Part Number 1: 399-8221-1-ND; Supplier 2: Mouser; Supplier Part Number 2: 80-C1210C105K5P
CN1S CN1W = SULLINS_10W_SIL_HDR_RA_2.54MM: CONN HDR 10POS 0.1 TIN PCB R/A; Manufacturer Part Number: PPTC101LGBN-RC; ComponentLink1Description: Datasheet - SULLINS; ComponentLink1URL: https://mm.digikey.com/Volume0/opasdata/d220001/medias/docus/937/Female_Headers.100_DS.pdf; Manufacturer: Sullins; Supplier 1: Digikey; Supplier Part Number 1: S5446-ND
CN2 = MOLEX_USB_MICRO_B_SMD_RA: CONN RCPT USB2.0 MICRO B SMD R/A; Manufacturer: Molex; Manufacturer Part Number: 47346-1001; Supplier 1: Digi-Key; Supplier Part Number 1: WM11228CT-ND; Supplier 2: Mouser; Supplier Part Number 2: 538-47346-1001; ComponentLink1Description: Datasheet - MOLEX; ComponentLink1URL: http://rhu103.sma-promail.com/SQLImages/kelmscott/Molex/PDF_Images/987650-3261.PDF?src-supplier=Digi-Key
D1 = NEXPERIA_BAS716,115_SOD523: DIODE STANDARD 75V 200MA SOD523; Manufacturer Part Number: BAS716115; Manufacturer: Nexperia; Supplier 1: Digikey; Supplier Part Number 1: 1727-4813-1-ND; Supplier 2: Mouser; Supplier Part Number 2: 771-BAS716-T/R; ComponentLink1Description: Datasheet - NEXPERIA; ComponentLink1URL: https://assets.nexperia.com/documents/data-sheet/BAS716.pdf
D3 D4 = DIODESINC_S1G_SMA_D0214AC: DIODE GEN PURP 400V 1A SMA; Manufacturer: Diodes; Manufacturer Part Number: S1G-13-F; Supplier 1: Digi-Key; Supplier Part Number 1: S1G-FDICT-ND; Supplier 2: Mouser; Supplier Part Number 2: 621-S1G-F; ComponentLink1Description: Datasheet - DIODESINC; ComponentLink1URL: https://datasheet.ciiva.com/4453/ds16003-83672-4453663.pdf?src-supplier=Mouser
L1 L7 = LAIRD_MI0805K601R-10: FERRITE BEAD 600 OHM 0805 1LN; Manufacturer: Laird; Manufacturer Part Number: MI0805K601R-10; Supplier 1: Digi-Key; Supplier Part Number 1: 240-2390-1-ND; Supplier 2: Mouser; Supplier Part Number 2: 875-MI0805K601R-10; ComponentLink1Description: Datasheet - LAIRD; ComponentLink1URL: https://datasheet.ciiva.com/1013/mi0805k601r-10-b-1013299.pdf?src-supplier=Digi-Key
M1 = MB-WIFI-CC3200Rev00: Module - Wi-Fi Module (CC3200)
P1 = BOURNS_MF-MSMF110-2: PTC RESET FUSE 24V 1.1A 1812; Manufacturer: Bourns; Manufacturer Part Number: MF-MSMF110/24X-2; ComponentLink1Description: Datasheet - BOURNS; ComponentLink1URL: https://www.bourns.com/docs/product-datasheets/mf-msmf.pdf; Supplier 1: Digikey; Supplier Part Number 1: MF-MSMF110/24X-2TR-ND; Supplier 2: Mouser; Supplier Part Number 2: 652-MF-MSMF110/24X-2
Q1 Q7 = IR_IRLML6402TRPBF_SOT23: MOSFET P-CH 20V 3.7A SOT23; Manufacturer: Infineon; Manufacturer Part Number: IRLML6402TRPBF; Supplier 1: Mouser; Supplier Part Number 1: 942-IRLML6402TRPBF; Supplier 2: Digikey; Supplier Part Number 2: IRLML6402PBFCT-ND; ComponentLink1Description: Datasheet - IR; ComponentLink1URL: https://www.infineon.com/dgdl/irlml6402pbf.pdf?fileId=5546d462533600a401535668d5c2263c
Q6 = ONSEMI_FDV301N_SOT23: MOSFET N-CH 25V 220MA SOT23; Manufacturer: ON Semiconductor / Fairchild; Manufacturer Part Number: FDV301N; Supplier 1: Digi-Key; Supplier Part Number 1: FDV301NCT-ND; Supplier 2: Mouser; Supplier Part Number 2: 512-FDV301N; ComponentLink1Description: Datasheet - ONSEMI; ComponentLink1URL: https://datasheet.ciiva.com/931/fdv301n-931766.pdf?src-supplier=Digi-Key
Q8 = ONSEMI_BC847BLT1G_SOT23: TRANS NPN 45V 100MA SOT23-3; Manufacturer: ON Semiconductor; Manufacturer Part Number: BC847BLT1G; Supplier 1: Digi-Key; Supplier Part Number 1: BC847BLT1GOSCT-ND; Supplier 2: Mouser; Supplier Part Number 2: 863-BC847BLT1G; ComponentLink1Description: Datasheet - ONSEMI; ComponentLink1URL: https://datasheet.ciiva.com/976/bc846alt1-d-976378.pdf?src-supplier=Digi-Key
R1 R2 R78-R83 R88 R92 R104 R106 = YAGEO_0603_T0.55: RES 0 OHM JUMPER 1/10W 0603; Manufacturer: Yageo; Manufacturer Part Number: RC0603FR-070RL; ComponentLink1Description: Datasheet - YAGEO; ComponentLink1URL: https://www.yageo.com/upload/media/product/productsearch/datasheet/rchip/PYu-RC_Group_51_RoHS_L_11.pdf; Supplier 1: Mouser; Supplier Part Number 1: 603-RC0603FR-070RL; Supplier 2: Digi-Key; Supplier Part Number 2: 311-0.0HRCT-ND
R3-R5 R7-R9 R15 R19 R26 R99 R101 R105 = YAGEO_0603_T0.55: RES 10K OHM 1% 1/10W 0603; Manufacturer: Yageo; Manufacturer Part Number: RC0603FR-0710KL; ComponentLink1Description: Datasheet - YAGEO; ComponentLink1URL: https://www.yageo.com/upload/media/product/productsearch/datasheet/rchip/PYu-RC_Group_51_RoHS_L_11.pdf; Supplier Part Number 1: 311-10.0KHRCT-ND; Supplier 2: Mouser; Supplier Part Number 2: 603-RC0603FR-0710KL
  R3-R5 R7-R9 R15 R19 R26 R99: Supplier 1: Digi-Key
  R101 R105: Supplier 1: Digikey
R11 R16 R27 = YAGEO_0603_T0.55: RES 15K OHM 1% 1/10W 0603; Manufacturer: Yageo; Manufacturer Part Number: RC0603FR-0715KL; ComponentLink1Description: Datasheet - YAGEO; ComponentLink1URL: https://www.yageo.com/upload/media/product/productsearch/datasheet/rchip/PYu-RC_Group_51_RoHS_L_11.pdf; Supplier 1: Digikey; Supplier Part Number 1: 311-15.0KHRCT-ND; Supplier 2: Mouser; Supplier Part Number 2: 603-RC0603FR-0715KL
R12 R17 = YAGEO_0603_T0.55: RES 120 OHM 1% 1/10W 0603; Manufacturer: Yageo; Manufacturer Part Number: RC0603FR-07120RL; ComponentLink1Description: Datasheet - YAGEO; ComponentLink1URL: https://www.yageo.com/upload/media/product/productsearch/datasheet/rchip/PYu-RC_Group_51_RoHS_L_11.pdf; Supplier 1: Digi-Key; Supplier Part Number 1: 311-120HRCT-ND; Supplier 2: Mouser; Supplier Part Number 2: 603-RC0603FR-07120RL
R13 R18 = YAGEO_0603_T0.55: RES 6.8K OHM 1% 1/10W 0603; Manufacturer: Yageo; Manufacturer Part Number: RC0603FR-076K8L; ComponentLink1Description: Datasheet - YAGEO; ComponentLink1URL: https://www.yageo.com/upload/media/product/productsearch/datasheet/rchip/PYu-RC_Group_51_RoHS_L_11.pdf; Supplier 1: Digikey; Supplier Part Number 1: 311-6.80KHRCT-ND; Supplier 2: Mouser; Supplier Part Number 2: 603-RC0603FR-076K8L
R14 = YAGEO_0603_T0.55: RES 33K OHM 1% 1/10W 0603; Manufacturer: Yageo; Manufacturer Part Number: RC0603FR-0733KL; ComponentLink1Description: Datasheet - YAGEO; ComponentLink1URL: https://www.yageo.com/upload/media/product/productsearch/datasheet/rchip/PYu-RC_Group_51_RoHS_L_11.pdf; Supplier 1: Digikey; Supplier Part Number 1: 311-33.0KHRCT-ND; Supplier 2: Mouser; Supplier Part Number 2: 603-RC0603FR-0733KL
R20 R22 = YAGEO_0603_T0.55: RES 100K OHM 1% 1/10W 0603; Manufacturer: Yageo; Manufacturer Part Number: RC0603FR-07100KL; ComponentLink1Description: Datasheet - YAGEO; ComponentLink1URL: https://www.yageo.com/upload/media/product/productsearch/datasheet/rchip/PYu-RC_Group_51_RoHS_L_11.pdf; Supplier 1: Digi-Key; Supplier Part Number 1: 311-100KHRCT-ND; Supplier 2: Mouser; Supplier Part Number 2: 603-RC0603FR-07100KL
R21 R23 R100 = YAGEO_0603_T0.55: RES 1K OHM 1% 1/10W 0603; Manufacturer: Yageo; Manufacturer Part Number: RC0603FR-071KL; ComponentLink1Description: Datasheet - YAGEO; ComponentLink1URL: https://www.yageo.com/upload/media/product/productsearch/datasheet/rchip/PYu-RC_Group_51_RoHS_L_11.pdf; Supplier 1: Digi-Key; Supplier Part Number 1: 311-1.00KHRCT-ND; Supplier 2: Mouser; Supplier Part Number 2: 603-RC0603FR-071KL
R24 R25 = YAGEO_0603_T0.55: RES 27 OHM 1% 1/10W 0603; Manufacturer: Yageo; Manufacturer Part Number: RC0603FR-0727RL; ComponentLink1Description: Datasheet - YAGEO; ComponentLink1URL: https://www.yageo.com/upload/media/product/productsearch/datasheet/rchip/PYu-RC_Group_51_RoHS_L_11.pdf; Supplier 1: Digikey; Supplier Part Number 1: 311-27.0HRTR-ND; Supplier 2: Mouser; Supplier Part Number 2: 603-RC0603FR-0727RL
R102 = YAGEO_0603_T0.55: RES 3.3K OHM 1% 1/10W 0603; Manufacturer: Yageo; Manufacturer Part Number: RC0603FR-073K3L; ComponentLink1Description: Datasheet - YAGEO; ComponentLink1URL: https://www.yageo.com/upload/media/product/productsearch/datasheet/rchip/PYu-RC_Group_51_RoHS_L_11.pdf; Supplier 1: Digikey; Supplier Part Number 1: 311-3.30KHRCT-ND; Supplier 2: Mouser; Supplier Part Number 2: 603-RC0603FR-073K3L
R103 = YAGEO_0603_T0.55: RES 330 OHM 1% 1/10W 0603; Manufacturer: Yageo; Manufacturer Part Number: RC0603FR-07330RL; ComponentLink1Description: Datasheet - YAGEO; ComponentLink1URL: https://www.yageo.com/upload/media/product/productsearch/datasheet/rchip/PYu-RC_Group_51_RoHS_L_11.pdf; Supplier 1: Digi-Key; Supplier Part Number 1: 311-330HRCT-ND; Supplier 2: Mouser; Supplier Part Number 2: 603-RC0603FR-07330RL
SW1A SW1B = COPAL_CHS-02B: SWITCH SLIDE DIP SPST 0.1A 6V; Manufacturer: Nidec Copal; Manufacturer Part Number: CHS-02B; Supplier 1: Digikey; Supplier Part Number 1: CHS-02B-ND; Supplier 2: Mouser; Supplier Part Number 2: 229-CHS-02B; ComponentLink1Description: Datasheet - COPAL; ComponentLink1URL: https://www.nidec-components.com/e/catalog/switch/chs.pdf
TH1 = NETWORKER_THERMISTOR: THER 10K 1% LEAD MMC SC25 (450103-006AQ)
U1 = STM_STM32F103RG_LQFP64: IC MCU 32BIT 1MB FLASH 64LQFP; Manufacturer: STMicroelectronics; Manufacturer Part Number: STM32F103RGT6; Supplier 1: Mouser; Supplier Part Number 1: 511-STM32F103RGT6; Supplier 2: Digikey; Supplier Part Number 2: 497-11118-ND; ComponentLink1Description: Product Page; ComponentLink1URL: https://www.st.com/en/microcontrollers-microprocessors/stm32f103rg.html#documentation; ComponentLink2Description: Datasheet - STM; ComponentLink2URL: https://datasheet.ciiva.com/6640/cd00253742-6640869.pdf?src-supplier=Digikey
U2 U3 = STM_M24M02-DR_SOIC8: IC EEPROM 2MBIT I2C 1MHZ 8SO; Manufacturer: STMicroelectronics; Manufacturer Part Number: M24M02-DRMN6TP; Supplier 1: Digi-Key; Supplier Part Number 1: 497-11600-6-ND; Supplier 2: Mouser; Supplier Part Number 2: 511-M24M02-DRMN6TP; ComponentLink1Description: Datasheet - STM; ComponentLink1URL: https://datasheet.ciiva.com/1912/cd00290537-1912487.pdf?src-supplier=Digi-Key
U5 U6 = EXAR_SP6205EM5-L_SOT23_5: IC REG LIN POS ADJ 500MA SOT23-5; Manufacturer: Exar; Manufacturer Part Number: SP6205EM5-L/TR; Supplier 1: Mouser; Supplier Part Number 1: 701-SP6205EM5-L/TR; Supplier 2: Digikey; Supplier Part Number 2: SP6205EM5-L/TR-ND; ComponentLink1Description: Datasheet - EXAR; ComponentLink1URL: https://datasheet.ciiva.com/26854/getdatasheetpartid-515131-26854433.pdf?src-supplier=Verical
U7 = FTDI_FT230XS_SSOP16: IC USB SERIAL BASIC UART 16SSOP; Manufacturer: FTDI; Manufacturer Part Number: FT230XS-U; Supplier 1: Mouser; Supplier Part Number 1: 895-FT230XS-U; Supplier 2: Digi-Key; Supplier Part Number 2: 768-1154-5-ND; ComponentLink1Description: Datasheet - FTDI; ComponentLink1URL: https://datasheet.ciiva.com/6630/ds-ft230x-6630901.pdf?src-supplier=Digi-Key
U35 = TI_TLV75533PDBVR_SOT23_5: IC REG LINEAR 3.3V 500MA SOT23-5; Manufacturer: Texas Instruments; Manufacturer Part Number: TLV75533PDBVR; Supplier 1: Mouser; Supplier Part Number 1: 595-TLV75533PDBVR; Supplier 2: Digikey; Supplier Part Number 2: 296-50411-1-ND; ComponentLink1Description: Datasheet - TI; ComponentLink1URL: https://www.ti.com/lit/ds/symlink/tlv755p.pdf?ts=1711517340379&ref_url=https%253A%252F%252Fwww.ti.com.cn%252Fproduct%252Fcn%252FTLV755P
V1-V3 = BOURNS_CGA0603MLC: VARISTOR 0603; Manufacturer: Bourns; Manufacturer Part Number: CG0603MLC-05E; Supplier 1: Digikey; Supplier Part Number 1: CG0603MLC-05ECT-ND; Supplier 2: Mouser; Supplier Part Number 2: 652-CG0603MLC-05E; ComponentLink1Description: Datasheet - BOURNS; ComponentLink1URL: https://www.bourns.com/docs/product-datasheets/cga-mlc.pdf
X1 = MURATA_CSTNE8M00G550000R0: CERAMIC RES 8.0000MHZ 33PF SMD; Manufacturer: Murata; Manufacturer Part Number: CSTNE8M00G550000R0; Supplier 1: Mouser; Supplier Part Number 1: 81-CSTNE8M00G550000R; Supplier 2: Digi-Key; Supplier Part Number 2: 490-17958-1-ND; ComponentLink1Description: Datasheet - MURATA; ComponentLink1URL: https://www.murata.com/en/products/productdata/8801161740318/SPEC-CSTNE8M00G550000R0.pdf?src-supplier=Digi-Key
X3 = EPSON_MC-146: CRYSTAL 32.7680KHZ 12.5PF SMD; Manufacturer: Epson; Manufacturer Part Number: MC-14632.7680KA-A0:ROHS; Supplier 1: Digikey; Supplier Part Number 1: SER4091CT-ND; Supplier 2: Mouser; Supplier Part Number 2: 732-MC146-32.7KAA0R; ComponentLink1Description: Datasheet - EPSON; ComponentLink1URL: https://support.epson.biz/td/api/doc_check.php?dl=brief_MC-146&lang=en